# Altium schematic sheet Motors_Encoders.SchDoc: Motors & Encoders
size A4; Organization: Use Organization_Name in ProjParam; Address1: EFI & DBR; Address2: STI-IMT-LSRO1; Address3: EPFL; Address4: CH-1015 LAUSANNE; DocumentNumber: 3; Revision: A; SheetNumber: 3; SheetTotal: 2; ApprovedBy: Init ApprovedBy in DocParam; CheckedBy: Init CheckedBy in DocParam; Author: Init Author in DocParam; CompanyName: Init CompanyName in DocParam; DrawnBy: Init DrawBy in DocParam; Engineer: Init Engineer in DocParam; DocumentName: Init DocumentName in DocParam; ProjectName: Init ProjectName in DocParam
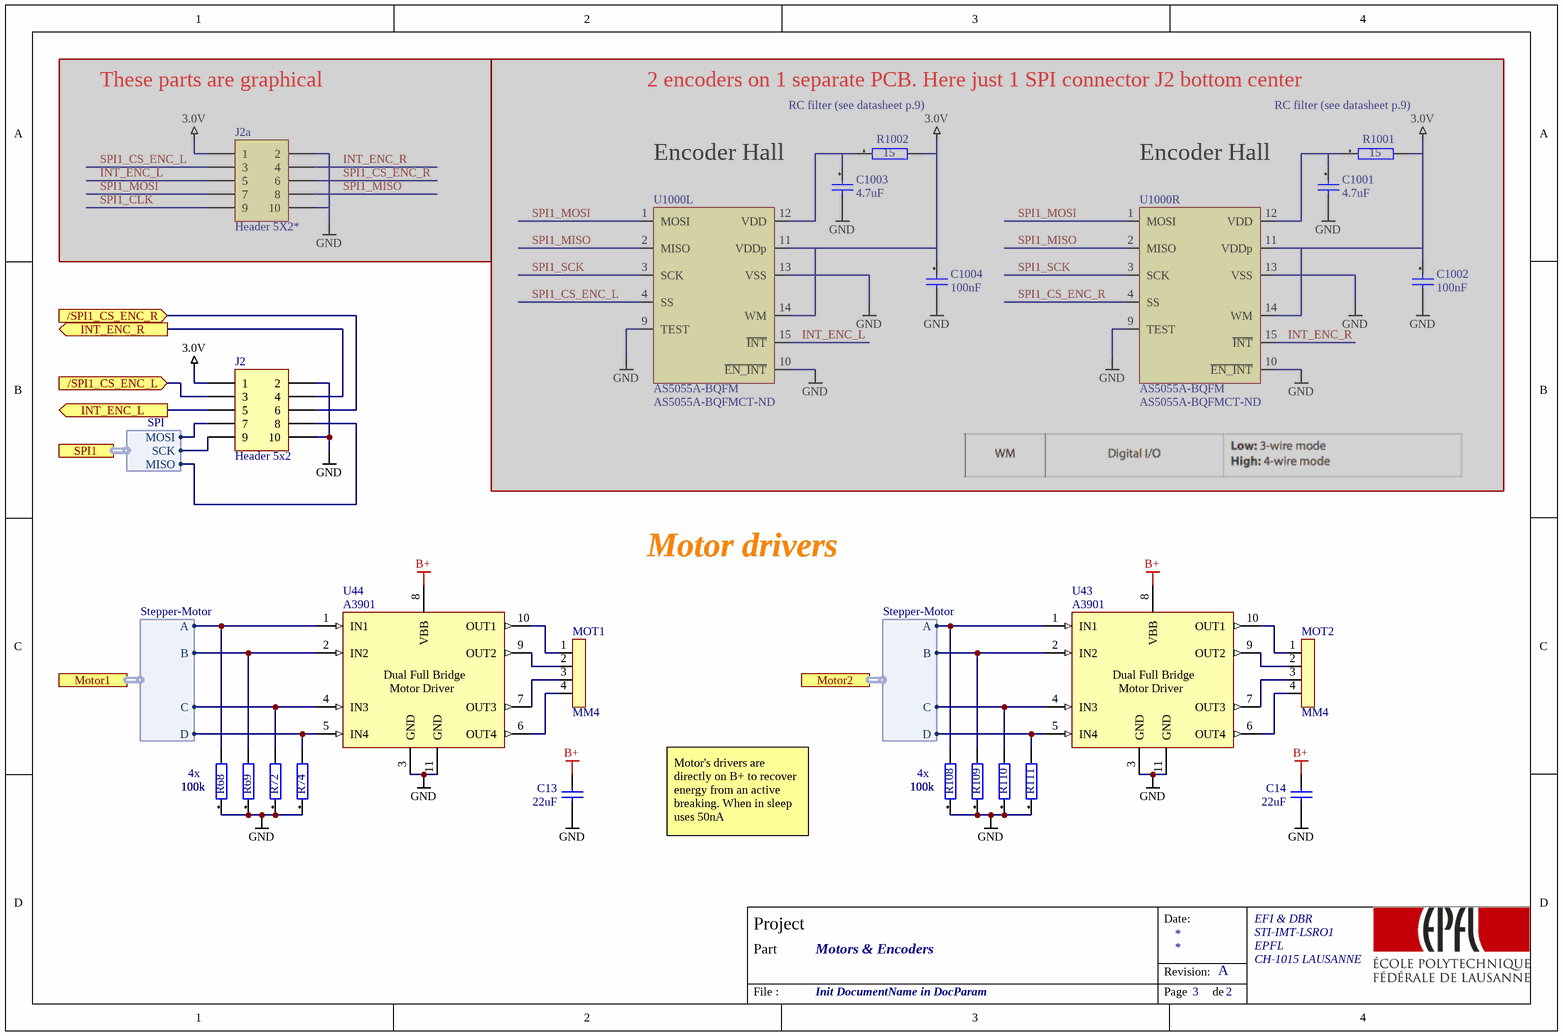
[diagram p0: Motors_Encoders.SchDoc]

## Parts
C13  22uF  [rob_0805b]
C14  22uF  [rob_0805b]
C1001  4.7uF  [ROB_0603]  (graphical)  (masked out: inside a compile mask, not in the netlist)
C1002  100nF  [ROB_0603]  (graphical)  (masked out: inside a compile mask, not in the netlist)
C1003  4.7uF  [ROB_0603]  (graphical)  (masked out: inside a compile mask, not in the netlist)
C1004  100nF  [ROB_0603]  (graphical)  (masked out: inside a compile mask, not in the netlist)
J2  Header 5x2  [HEADER2X5 0.8mm]
J2a  Header 5X2*  [HEADER2X5 0.8mm Vertical]  (graphical)  (masked out: inside a compile mask, not in the netlist)
MOT1  MM4  [mm4smd]
MOT2  MM4  [mm4smd]
R68  100k  [ROB_0603]
R69  100k  [ROB_0603]
R72  100k  [ROB_0603]
R74  100k  [ROB_0603]
R108  100k  [ROB_0603]
R109  100k  [ROB_0603]
R110  100k  [ROB_0603]
R111  100k  [ROB_0603]
R1001  Résistance (Ohms): 15  [ROB_0603]  (hidden comment: RC0603JR-0715RL)  (graphical)  (masked out: inside a compile mask, not in the netlist)
R1002  Résistance (Ohms): 15  [ROB_0603]  (hidden comment: RC0603JR-0715RL)  (graphical)  (masked out: inside a compile mask, not in the netlist)
U43  A3901  [DFN-10]
U44  A3901  [DFN-10]
U1000L  Supplier Part Number 1: AS5055A-BQFMCT-ND  [QFN4X4-16 - EPAD unconnected]  (hidden comment: AS5055A-BQFM)  (graphical)  (masked out: inside a compile mask, not in the netlist)
U1000R  Supplier Part Number 1: AS5055A-BQFMCT-ND  [QFN4X4-16 - EPAD unconnected]  (hidden comment: AS5055A-BQFM)  (graphical)  (masked out: inside a compile mask, not in the netlist)

## Ports
/SPI1_CS_ENC_L (in), /SPI1_CS_ENC_R (in), INT_ENC_L (out), INT_ENC_R (out), Motor1 (harness Stepper-Motor), Motor2 (harness Stepper-Motor), SPI1 (harness SPI)

## Harnesses
Stepper-Motor: A, B, C, D
SPI: SCK, MOSI, MISO

## Nets
3.0V: J2.1
B+: C13.2 C14.2 U43.8(VBB) U44.8(VBB)
GND: C13.1 C14.1 J2.2 J2.10 R68.1 R69.1 R72.1 R74.1 R108.1 R109.1 R110.1 R111.1 U43.3(GND) U43.11(GND) U44.3(GND) U44.11(GND)
/SPI1_CS_ENC_L: J2.3 ; port /SPI1_CS_ENC_L
/SPI1_CS_ENC_R: J2.6 ; port /SPI1_CS_ENC_R
INT_ENC_L: J2.5 ; port INT_ENC_L
INT_ENC_R: J2.4 ; port INT_ENC_R
NetJ2_7: J2.7 ; port SPI1.MOSI
NetJ2_8: J2.8 ; port SPI1.MISO
NetJ2_9: J2.9 ; port SPI1.SCK
NetMOT1_1: MOT1.1 U44.10(OUT1)
NetMOT1_2: MOT1.2 U44.9(OUT2)
NetMOT1_3: MOT1.3 U44.7(OUT3)
NetMOT1_4: MOT1.4 U44.6(OUT4)
NetMOT2_1: MOT2.1 U43.10(OUT1)
NetMOT2_2: MOT2.2 U43.9(OUT2)
NetMOT2_3: MOT2.3 U43.7(OUT3)
NetMOT2_4: MOT2.4 U43.6(OUT4)
NetR68_2: R68.2 U44.1(IN1) ; port Motor1.A
NetR69_2: R69.2 U44.2(IN2) ; port Motor1.B
NetR72_2: R72.2 U44.4(IN3) ; port Motor1.C
NetR74_2: R74.2 U44.5(IN4) ; port Motor1.D
NetR108_2: R108.2 U43.1(IN1) ; port Motor2.A
NetR109_2: R109.2 U43.2(IN2) ; port Motor2.B
NetR110_2: R110.2 U43.4(IN3) ; port Motor2.C
NetR111_2: R111.2 U43.5(IN4) ; port Motor2.D

## Notes on the sheet
- These parts are graphical
- 2 encoders on 1 separate PCB. Here just 1 SPI connector J2 bottom center
- (near R1002) RC filter (see datasheet p.9)
- (near R1001) RC filter (see datasheet p.9)
- Encoder Hall
- Motor drivers
- (near R68) 4x
- (near R108) 4x
- Motor's drivers are directly on B+ to recover energy from an active breaking. When in sleep uses 50nA
- Date:
- Project
- Part
- Revision:
- File :
- Page
- de
- (in symbol A3901SEJTR[[/\]]1) Dual Full Bridge / Motor Driver

## Library data of the parts
C13 C14 = Cap: Capacitor; Published: 8-Jun-2000; LatestRevisionDate: 17-Jul-2002; LatestRevisionNote: Re-released for DXP Platform.; PackageReference: RAD-0.3; Publisher: Altium Limited; Value: 22uF
C1001 C1003 = 4.7uF[[/\]]0603[[/\]]1: Capacitor; Manufacturer: Kemet; Manufacturer Nr: C0603C475K9PAC; Preference: 1; Tolerance +: +10; Tolerance -: -10; Dielectric: X5R; Voltage: 6.3; MaxTemperature: +85; MinTemperature: -55; Quant_1: 10; Quant_2: 100; Quant_3: 1000; Quant_4: 4000; Currentie: CHF; Size: 0603; Footprint Acort: 0603_G; Supplier: Farnell; Supplier Nr: 9227784; ComponentLink2Description: Farnell link; ComponentLink2URL: http://ch.farnell.com/jsp/displayProduct.jsp?sku=9227784; Price_1: 0,33; Price_2: 0,298; Price_3: 0,278; Price_4: 0,246; ROHS: True; DateLastUpdate: 2007-12-03 / 14:22:57
C1002 C1004 = 100nF[[/\]]0603[[/\]]1: Capacitor; Manufacturer: Kemet; Manufacturer Nr: C0603C104K5RAC; Preference: 1; Tolerance +: +10; Tolerance -: -10; Dielectric: X7R; Voltage: 50; MaxTemperature: +125; MinTemperature: -55; Quant_1: 10; Quant_2: 100; Quant_3: 1000; Quant_4: 4000; Currentie: CHF; Size: 0603; Footprint Acort: 0603_G; Supplier: Farnell; Supplier Nr: 1288255; ComponentLink2Description: Farnell link; ComponentLink2URL: http://ch.farnell.com/jsp/displayProduct.jsp?sku=1288255; Price_1: 0,046; Price_2: 0,04; Price_3: 0,037; Price_4: 0,036; ROHS: True; DateLastUpdate: 2007-12-03 / 14:22:31
J2 = Header 5X2: Encoder PCB connection; Manufacturer: Generic Components; Class I: Connector; Revision: July-2002: Re-released for DXP Platform.; Publisher: Altium Limited
J2a = Header 5X2: Header, 5-Pin, Dual row; Manufacturer: Generic Components; Class I: Connector; Revision: July-2002: Re-released for DXP Platform.; Publisher: Altium Limited
MOT1 MOT2 = MM4: MicroMatch 4 SMD vertical; value: civilux CA3204M1300
R68 R69 R72 R74 R108-R111 = 100K[[/\]]0603[[/\]]2: Resistor; Manufacturer: Multicomp; Manufacturer Nr: MC 0.063W 0603 1% 100K; Tolerance: +/-1; Preference: 2; Power: 0.063; Voltage: 50; Current: 1; ppm/K: +/-100; Quant_2: 250; Quant_3: 1000; Quant_4: 5000; Quant_5: 15000; Currentie: CHF; Value: 100k; Size: 0603; Footprint Acort: 0603; ComponentLink1Description: OnLine datasheet; Supplier: Farnell; Supplier Nr: 9330402; ComponentLink2Description: Farnell link; ComponentLink2URL: http://ch.farnell.com/jsp/displayProduct.jsp?sku=9330402; ROHS: True; Quant_1: 50; Price_1: 0,062; Price_2: 0,049; Price_3: 0,038; Price_4: 0,027; Price_5: 0,021; DateLastUpdate: 2007-11-29 / 09:15:00
R1001 R1002 = RC0603JR-0715RL: RES SMD 15 OHM 5% 1/10W 0603; Manufacturer: Yageo; Conditionnement: Bande coupée (CT); Statut de la pièce: Actif; Puissance (Watts): 0,1 W, 1/10 W; Caractéristiques: Résistant à l’humidité; Coefficient de température: ±100 ppm/°C; Température d’utilisation: -55°C ~ 155°C; Boîtier: 0603 (1608 Metric); Boîtier fournisseur: 0603; Hauteur - Installé (max): 0,022 po (0,55 mm); Supplier 1: Digi-Key; Manufacturer Part Number: RC0603JR-0715RL; RoHS: RoHS Compliant; Category: Résistances; Stock 1: 321643; Pricing 1: 1=0.09, 10=0.009, 25=0.0068, 50=0.005, 100=0.0038, 250=0.00292, 500=0.0023, 1000=0.0017 (EUR); Composition: Couche épaisse; Taille/Dimension: 0,063 po L x 0,031 po l (1,60 mm x 0,80 mm); Taux d'échec: -; ComponentLink1URL: http://www.yageo.com/documents/recent/PYu-RC_Group_51_RoHS_L_6.pdf; ComponentLink1Description: http://www.yageo.com/documents/recent/PYu-RC_Group_51_RoHS_L_6.pdf; Tolérance: ±5%; Supplier Part Number 1: 311-15GRCT-ND
U43 U44 = A3901SEJTR[[/\]]1: IC : Dual Full Bridge Low Voltage Motor Driver; Manufacturer: Allegro; Manufacturer Nr: A3901SEJTR-T; Preference: 1; Quant_2: 10; Quant_3: 30; Quant_4: 60; Quant_5: 200; Quant_6: 600; Currentie: CHF; Size: DFN10; Footprint Acort: ToDefine; ComponentLink1Description: Allegro link; ComponentLink1URL: http://www.allegromicro.com/en/Products/Motor-Driver-And-Interface-ICs/Bipolar-Stepper-Motor-Drivers/A3901.aspx; Supplier: Farnell; Supplier Nr: 1651947; ComponentLink2Description: Farnell link; ComponentLink2URL: http://ch.farnell.com/jsp/displayProduct.jsp?sku=1651947; Quant_1: 1; Price_1: 2.02; Price_2: 1.85; Price_3: 1.67; Price_4: 1.5; Price_5: 1.36; Price_6: 0.66; ROHS: True; DateLastUpdate: 2014-09-18 / 10:42:25
U1000L U1000R = AS5055A-BQFM: IC ENCODER ROTARY 12BIT 16QFN; Manufacturer: ams; Statut de la pièce: Actif; Pour la mesure: Angle; Technologie: Effet Hall; Angle de rotation - Électrique, mécanique: 0° ~ 360°, Modes continue; Sortie: SPI; Type d’actionneur: Aimant externe, non inclus; Linéarité: ±1,41°; Alimentation en tension: 3 V ~ 3,6 V; Type de montage: Montage en surface; Style de terminaison: Languette CMS (SMT); Température d’utilisation: -40°C ~ 85°C; Supplier 1: Digi-Key; RoHS: RoHS Compliant; Category: Capteurs, transducteurs; Stock 1: 6192; Pricing 1: 1=6.54, 10=5.885, 25=5.362, 100=4.8388, 250=4.44644 (EUR); Plage linéaire: -; Signal de sortie: -; Résistance (Ohms): -; Tolérance de résistance: -; ComponentLink1URL: http://ams.com/eng/content/download/552323/1541717/300455; ComponentLink1Description: http://ams.com/eng/content/download/552323/1541717/300455; Manufacturer Part Number: AS5055A-BQFM